# Altium schematic sheet TestBoard.SchDoc: Tray Board for Photonic Chip
size A4; Date: Mar 22, 2023; Author: Yinyi (Shannon) LIU; SheetNumber: 1; SheetTotal: 2
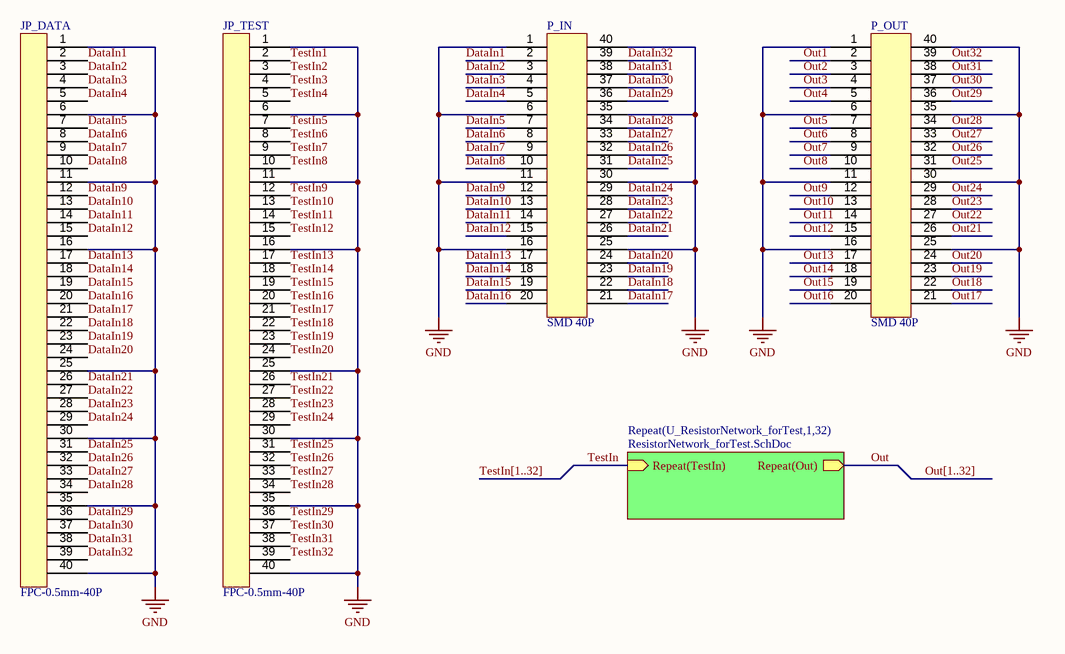
[diagram p0: TestBoard.SchDoc]

## Parts
JP_DATA  FPC-0.5mm-40P  [FPC0.5 2H-WS-40P]
JP_TEST  FPC-0.5mm-40P  [FPC0.5 2H-WS-40P]
P_IN  SMD 40P  [SMD-40P-W0.2-H0.6-T0.4]
P_OUT  SMD 40P  [SMD-40P-W0.2-H0.6-T0.4]

## Sub-sheets
Repeat(U_ResistorNetwork_forTest,1,32) = ResistorNetwork_forTest.SchDoc: Repeat(TestIn) (in), Repeat(Out) (out)

## Nets
GND: JP_DATA.1 JP_DATA.6 JP_DATA.11 JP_DATA.16 JP_DATA.25 JP_DATA.30 JP_DATA.35 JP_DATA.40 JP_TEST.1 JP_TEST.6 JP_TEST.11 JP_TEST.16 JP_TEST.25 JP_TEST.30 JP_TEST.35 JP_TEST.40 P_IN.1 P_IN.6 P_IN.11 P_IN.16 P_IN.25 P_IN.30 P_IN.35 P_IN.40 P_OUT.1 P_OUT.6 P_OUT.11 P_OUT.16 P_OUT.25 P_OUT.30 P_OUT.35 P_OUT.40
DataIn1: JP_DATA.2 P_IN.2
DataIn2: JP_DATA.3 P_IN.3
DataIn3: JP_DATA.4 P_IN.4
DataIn4: JP_DATA.5 P_IN.5
DataIn5: JP_DATA.7 P_IN.7
DataIn6: JP_DATA.8 P_IN.8
DataIn7: JP_DATA.9 P_IN.9
DataIn8: JP_DATA.10 P_IN.10
DataIn9: JP_DATA.12 P_IN.12
DataIn10: JP_DATA.13 P_IN.13
DataIn11: JP_DATA.14 P_IN.14
DataIn12: JP_DATA.15 P_IN.15
DataIn13: JP_DATA.17 P_IN.17
DataIn14: JP_DATA.18 P_IN.18
DataIn15: JP_DATA.19 P_IN.19
DataIn16: JP_DATA.20 P_IN.20
DataIn17: JP_DATA.21 P_IN.21
DataIn18: JP_DATA.22 P_IN.22
DataIn19: JP_DATA.23 P_IN.23
DataIn20: JP_DATA.24 P_IN.24
DataIn21: JP_DATA.26 P_IN.26
DataIn22: JP_DATA.27 P_IN.27
DataIn23: JP_DATA.28 P_IN.28
DataIn24: JP_DATA.29 P_IN.29
DataIn25: JP_DATA.31 P_IN.31
DataIn26: JP_DATA.32 P_IN.32
DataIn27: JP_DATA.33 P_IN.33
DataIn28: JP_DATA.34 P_IN.34
DataIn29: JP_DATA.36 P_IN.36
DataIn30: JP_DATA.37 P_IN.37
DataIn31: JP_DATA.38 P_IN.38
DataIn32: JP_DATA.39 P_IN.39
Out: sheet Repeat(U_ResistorNetwork_forTest,1,32)/Repeat(Out)
Out1: P_OUT.2
Out2: P_OUT.3
Out3: P_OUT.4
Out4: P_OUT.5
Out5: P_OUT.7
Out6: P_OUT.8
Out7: P_OUT.9
Out8: P_OUT.10
Out9: P_OUT.12
Out10: P_OUT.13
Out11: P_OUT.14
Out12: P_OUT.15
Out13: P_OUT.17
Out14: P_OUT.18
Out15: P_OUT.19
Out16: P_OUT.20
Out17: P_OUT.21
Out18: P_OUT.22
Out19: P_OUT.23
Out20: P_OUT.24
Out21: P_OUT.26
Out22: P_OUT.27
Out23: P_OUT.28
Out24: P_OUT.29
Out25: P_OUT.31
Out26: P_OUT.32
Out27: P_OUT.33
Out28: P_OUT.34
Out29: P_OUT.36
Out30: P_OUT.37
Out31: P_OUT.38
Out32: P_OUT.39
TestIn: sheet Repeat(U_ResistorNetwork_forTest,1,32)/Repeat(TestIn)
TestIn1: JP_TEST.2
TestIn2: JP_TEST.3
TestIn3: JP_TEST.4
TestIn4: JP_TEST.5
TestIn5: JP_TEST.7
TestIn6: JP_TEST.8
TestIn7: JP_TEST.9
TestIn8: JP_TEST.10
TestIn9: JP_TEST.12
TestIn10: JP_TEST.13
TestIn11: JP_TEST.14
TestIn12: JP_TEST.15
TestIn13: JP_TEST.17
TestIn14: JP_TEST.18
TestIn15: JP_TEST.19
TestIn16: JP_TEST.20
TestIn17: JP_TEST.21
TestIn18: JP_TEST.22
TestIn19: JP_TEST.23
TestIn20: JP_TEST.24
TestIn21: JP_TEST.26
TestIn22: JP_TEST.27
TestIn23: JP_TEST.28
TestIn24: JP_TEST.29
TestIn25: JP_TEST.31
TestIn26: JP_TEST.32
TestIn27: JP_TEST.33
TestIn28: JP_TEST.34
TestIn29: JP_TEST.36
TestIn30: JP_TEST.37
TestIn31: JP_TEST.38
TestIn32: JP_TEST.39

## Buses and harness runs
bus Out[1..32]
bus TestIn[1..32]

## Notes on the sheet
- Title
- FileName:
- Version:
- Date:
- Project
- Designed By:
- Descriptions:
- Sheet:
- of

## Library data of the parts
JP_DATA JP_TEST = FPC-0.5mm-40P: FPC Connector 0.5mm 40PIN
P_IN P_OUT = SMD 40P: SMD Pad for Chip Bonding (40 PIN).